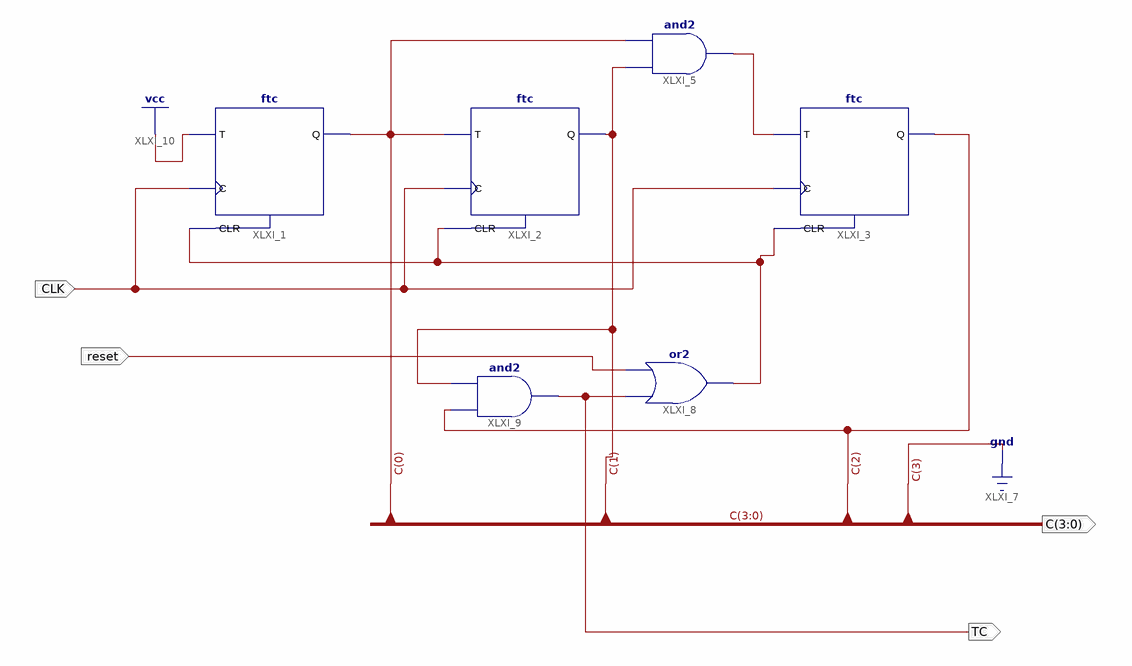
[diagram p0: schematic sheet 1]
// Xilinx ISE schematic counter0_5.sch (spartan6) as structural Verilog: 6 symbols, 4 ports
module counter0_5 (
  input  reset,
  input  CLK,
  output [3:0] C,
  output TC
);

  wire XLXN_6, XLXN_24;

  ftc XLXI_1 (.C(CLK), .CLR(XLXN_24), .T(1'b1), .Q(C[0]));
  ftc XLXI_2 (.C(CLK), .CLR(XLXN_24), .T(C[0]), .Q(C[1]));
  ftc XLXI_3 (.C(CLK), .CLR(XLXN_24), .T(XLXN_6), .Q(C[2]));
  and XLXI_5 (XLXN_6, C[1], C[0]);
  or XLXI_8 (XLXN_24, TC, reset);
  and XLXI_9 (TC, C[2], C[1]);

  assign C[3] = 1'b0;
endmodule
